# EAGLE schematic Blow out LED tree - test circuit v1 (EAGLE 9.7.0)
LED CONTROL BLOCK
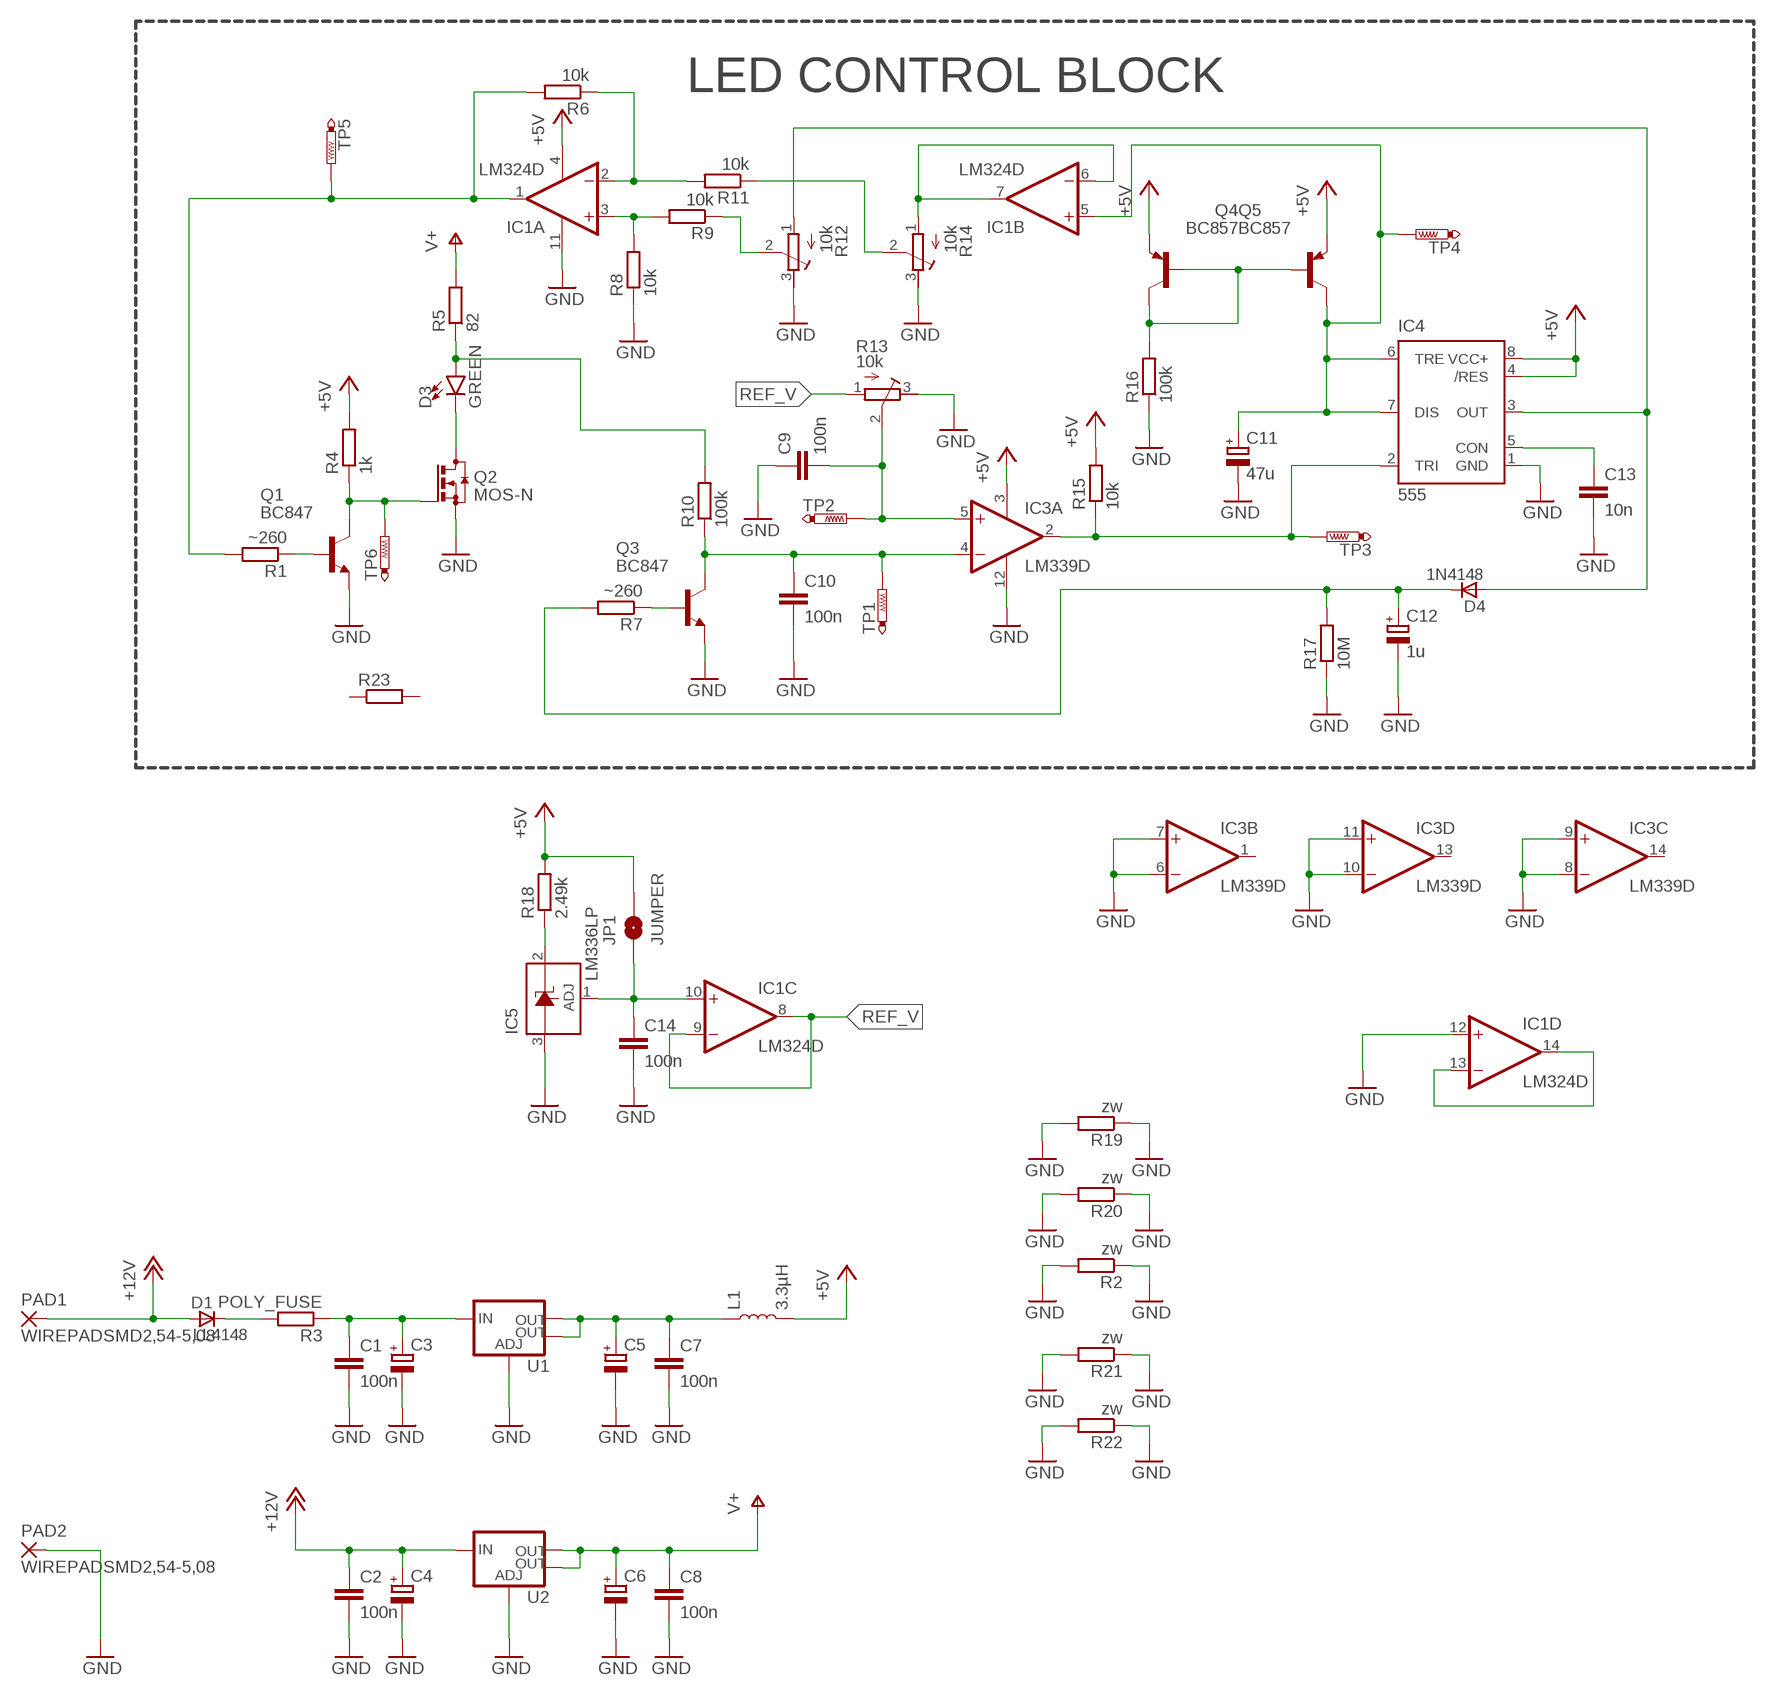
[diagram p0: schematic, sheet 1]

## Parts
C1  100n  C-EUC1206  [C1206]
C2  100n  C-EUC1206  [C1206]
C3  CPOL-EU153CLV-0810  [153CLV-0810]
C4  CPOL-EU153CLV-0810  [153CLV-0810]
C5  CPOL-EU153CLV-0810  [153CLV-0810]
C6  CPOL-EU153CLV-0810  [153CLV-0810]
C7  100n  C-EUC1206  [C1206]
C8  100n  C-EUC1206  [C1206]
C9  100n  C-EUC1206  [C1206]
C10  100n  C-EUC1206  [C1206]
C11  47u  CPOL-EU153CLV-0605  [153CLV-0605]
C12  1u  CPOL-EU153CLV-0605  [153CLV-0605]
C13  10n  C-EUC1206  [C1206]
C14  100n  C-EUC1206  [C1206]
D1  LL4148  [SOD80_DO213AA_MINIMELF]
D3  GREEN  LED-FKIT-1206  [FKIT-LED-1206]
D4  1N4148  LL4148  [SOD80_DO213AA_MINIMELF]
IC1  LM324D  [SO14]
IC3  LM339D  [SO14]
IC4  555  555D  [SO08]
IC5  LM336LP  [TO92]
JP1  JUMPER  JUMPER-SMT_2_NO_NO-SILK_ROUND  [SMT-JUMPER_2_NO_NO-SILK_ROUND]
L1  3.3µH  INDUCTOR-0805-3.3UH  [0805]
PAD1  WIREPADSMD2,54-5,08  [SMD2,54-5,08]
PAD2  WIREPADSMD2,54-5,08  [SMD2,54-5,08]
Q1  BC847  BC847ASMD  [SOT23]
Q2  MOS-N  BSS123  [SOT23]
Q3  BC847  BC847ASMD  [SOT23]
Q4  BC857  BC857ALT1SMD  [SOT23-BEC]
Q5  BC857  BC857ALT1SMD  [SOT23-BEC]
R1  ~260  R-EU_R1206  [R1206]
R2  zw  R-EU_R1206  [R1206]
R3  POLY_FUSE  R-EU_R1206  [R1206]
R4  1k  R-EU_R1206  [R1206]
R5  82  R-EU_R1206  [R1206]
R6  10k  R-EU_R1206  [R1206]
R7  ~260  R-EU_R1206  [R1206]
R8  10k  R-EU_R1206  [R1206]
R9  10k  R-EU_R1206  [R1206]
R10  100k  R-EU_R1206  [R1206]
R11  10k  R-EU_R1206  [R1206]
R12  10k  R-TRIMM3374  [RTRIM3374]
R13  10k  R-TRIMM3374  [RTRIM3374]
R14  10k  R-TRIMM3374  [RTRIM3374]
R15  10k  R-EU_R1206  [R1206]
R16  100k  R-EU_R1206  [R1206]
R17  10M  R-EU_R1206  [R1206]
R18  2.49k  R-EU_R1206  [R1206]
R19  zw  R-EU_R1206  [R1206]
R20  zw  R-EU_R1206  [R1206]
R21  zw  R-EU_R1206  [R1206]
R22  zw  R-EU_R1206  [R1206]
R23  R-EU_R0603  [R0603]
TP1  PTR1B2,54  [B2,54]
TP2  PTR1B2,54  [B2,54]
TP3  PTR1B2,54  [B2,54]
TP4  PTR1B2,54  [B2,54]
TP5  PTR1B2,54  [B2,54]
TP6  PTR1B2,54  [B2,54]
U1  V_REG_LM1117SOT223  [SOT223]
U2  V_REG_LM1117SOT223  [SOT223]

## Nets
+5V: IC1.4(P:V+) IC3.3(P:V+) IC4.4(/RES) IC4.8(VCC+) JP1.2 L1.2 Q4.E Q5.E R4.2 R15.2 R18.2
+12V: C2.1 C4.+ D1.A PAD1.1(P) U2.3(IN)
GND: C1.2 C2.2 C3.- C4.- C5.- C6.- C7.2 C8.2 C9.1 C10.2 C11.- C12.- C13.2 C14.2 IC1.11(P:V-) IC1.12(D:+IN) IC3.6(B:-IN) IC3.7(B:+IN) IC3.8(C:-IN) IC3.9(C:+IN) IC3.10(D:-IN) IC3.11(D:+IN) IC3.12(P:GND) IC4.1(GND) IC5.3(A) PAD2.1(P) Q1.2(E) Q2.2(S) Q3.2(E) R2.1 R2.2 R8.1 R12.3(E) R13.3(E) R14.3(E) R16.1 R17.1 R19.1 R19.2 R20.1 R20.2 R21.1 R21.2 R22.1 R22.2 U1.1(ADJ) U2.1(ADJ)
N$1: D3.A R5.1 R10.2
N$3: C14.1 IC1.10(C:+IN) IC5.1(ADJ) JP1.1
N$4: C10.1 IC3.4(A:-IN) Q3.3(C) R10.1 TP1.TP
N$5: C9.2 IC3.5(A:+IN) R13.2(S) TP2.TP
N$6: Q3.1(B) R7.1
N$7: Q4.B Q4.C Q5.B R16.2
N$8: IC1.6(B:-IN) IC1.7(B:OUT) R14.1(A)
N$9: IC3.2(A:OUT) IC4.2(TRI) R15.1 TP3.TP
N$10: C13.1 IC4.5(CON)
N$11: D4.A IC4.3(OUT) R12.1(A)
N$12: C12.+ D4.C R7.2 R17.2
N$13: IC1.3(A:+IN) R8.2 R9.2
N$14: C11.+ IC1.5(B:+IN) IC4.6(TRE) IC4.7(DIS) Q5.C TP4.TP
N$15: IC1.2(A:-IN) R6.1 R11.2
N$16: IC1.1(A:OUT) R1.2 R6.2 TP5.TP
N$17: R11.1 R14.2(S)
N$18: R9.1 R12.2(S)
N$19: IC5.2(C) R18.1
N$20: Q1.3(C) Q2.1(G) R4.1 TP6.TP
N$21: Q1.1(B) R1.1
N$22: IC1.13(D:-IN) IC1.14(D:OUT)
N$23: D1.C R3.2
N$24: C1.1 C3.+ R3.1 U1.3(IN)
N$25: C5.+ C7.1 L1.1 U1.2(OUT) U1.4(OUT)
N$26: D3.C Q2.3(D)
REF_V: IC1.8(C:OUT) IC1.9(C:-IN) R13.1(A)
V+: C6.+ C8.1 R5.2 U2.2(OUT) U2.4(OUT)
Unconnected: IC3.1(B:OUT) IC3.13(D:OUT) IC3.14(C:OUT) R23.1 R23.2

## Notes on the sheet
- LED CONTROL BLOCK

## Library data of the parts
C1 C2 C7-C10 C13 C14 = rcl:C-EU: CAPACITOR, European symbol; SPICEPREFIX: C
C3-C6 C11 C12 = rcl:CPOL-EU: POLARIZED CAPACITOR, European symbol; SPICEPREFIX: C
D1 D4 = _hhn_diodes_smd:LL4148: 1N4148 General Purpose Rectifie SMD-Version of 1N4148 Case: SOD 80 = DO 213 AA = MINIMELF (Glass) Author: Dipl.-Ing. FH Rainer Bayer HHN Hochschule Heilbronn, rainer.bayer@hs-heilbronn.de Ingenieurbüro ing-rb, mail@ing-rb.de
D3 = SparkFun-LED:LED: LED (Generic) Standard schematic elements and footprints for 5mm, 3mm, 1206, and 0603 sized LEDs. Generic LEDs with no color specified.
IC1 = linear:LM324: OP AMP
IC3 = linear3:LM339: Low Power Low Offset Voltage Quad Comparators with open collector; LM139/LM239/LM339/LM2901/LM3302
IC4 = SparkFun-IC-Special-Function:555: General purpose bipolar Timer Datasheet <http://www.sparkfun.com/datasheets/Components/General/ne555.pdf> SparkFun Products SparkFun SparkPunk Sequencer Kit <https://www.sparkfun.com/products/12707> (KIT-12707) Storefront Component: 555 Timer <https://www.sparkfun.com/products/9273> (COM-09273) Two parts valid for production: VFP: IC-11930 (M7555 PTH) VFP: IC-09173 (555 PTH) - Preferred; PROD_ID: NA-XXXXX
IC5 = linear:LM336: 2.5-V INTEGRATED REFERENCE CIRCUITS LM236 Source: http://focus.ti.com/lit/ds/symlink/lm336-2.5.pdf
JP1 = SparkFun-Jumpers:JUMPER-SMT_2_NO: Normally open jumper This jumper has two pads in close proximity to each other. Apply solder to close the connection. Round pads are easier to solder for beginners, but are a lot larger. SparkFun Product that uses the round pads: SparkFun EL Sequencer <https://www.sparkfun.com/products/12781>
L1 = SparkFun-Coils:INDUCTOR: Inductors Resist changes in electrical current. Basically a coil of wire. SparkFun Products: SparkFun Load Cell Amplifier - HX711 <https://www.sparkfun.com/products/13879> IOIO-OTG - V2.2 <https://www.sparkfun.com/products/13613>; PROD_ID: NDUC-13076; VALUE: 3.3µH/±20%/450mA
PAD1 PAD2 = wirepad:WIREPAD: Wire PAD connect wire on PCB
Q1 Q3 = transistor-npn:BC847*: NPN Transistor
Q2 = transistor-small-signal:BSS123: N-CHANNEL MOS FET
Q4 Q5 = transistor-pnp:BC857*: PNP Transistror
R1-R11 R15-R23 = rcl:R-EU_: RESISTOR, European symbol; SPICEPREFIX: R
R12-R14 = rcl:R-TRIMM: Trimm resistor; SPICEMODEL: X; SPICEPREFIXL: POT
TP1-TP6 = testpad:PTR1: TEST PIN
U1 U2 = SparkFun-IC-Power:V_REG_LM1117: Voltage Regulator LM1117 Standard adjustable voltage regulator but in SMD form. Spark Fun Electronics SKU : COM-00595; PROD_ID: VREG-08170